# Altium schematic sheet Printer.SchDoc: Smart Bus Ticketing Machine/Outputs/Printer
size A; ApprovedBy: Kiran Gunathilaka; CheckedBy: Kiran Gunathilaka; Author: Kiran Gunathilaka; DrawnBy: Kiran Gunathilaka; Engineer: Kiran Gunathilaka; DocumentNumber: 10; Revision: v1.2; SheetNumber: 10; SheetTotal: 11
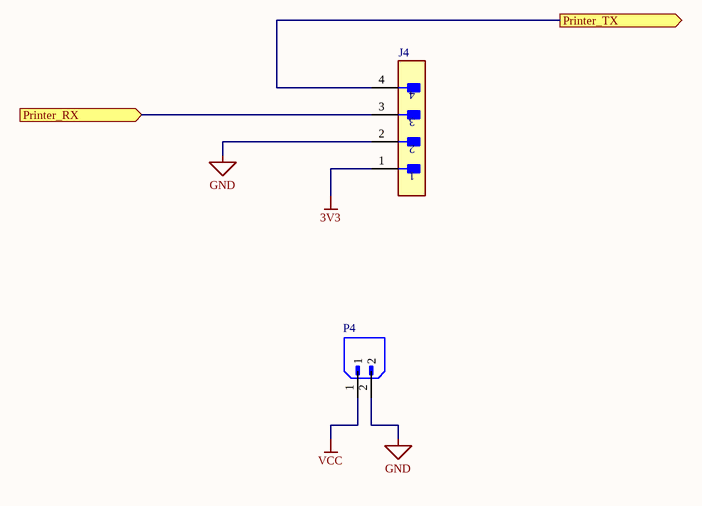
[diagram p0: Printer.SchDoc]

## Parts
J4  B04B-XASK-1(LF)(SN)  [FP-B04B-XASK-1_LF_SN-MFG]  (value not drawn)
P4  Battery Connector  [JST_B2B-XH-A(LF)(SN)]  (value not drawn)

## Ports
Printer_RX (in, see Outputs[3C], Outputs[2C]), Printer_TX (out, see Outputs[3C], Outputs[4C])

## Nets
3V3: J4.1
GND: J4.2 P4.2
VCC: P4.1
Printer_RX: J4.3 ; port Printer_RX
Printer_TX: J4.4 ; port Printer_TX

## Library data of the parts
J4 = CMP-17439-000018-1: CONN HEADER VERT 4POS 2.5MM; Manufacturer: JST; Current Rating: 3A; Voltage Rating: 250V; Conn Orientation: Straight; Conn Gender: Male; Number Of Contacts: 4; ComponentLink2Description: Datasheet; Package: B04B-XASK-1(LF)(SN); Octopart: https://octopart.com/b04b-xask-1%28lf%29%28sn%29-jst-3990149; Pitch: 2.5mm; Device Class L1: Connectors; RoHS: TRUE; Device Class L3: unset; Manufacturer Part Number: B04B-XASK-1(LF)(SN); Temperature Range High: +85°C; Height: 8.8mm; Lead Free: Yes; Category: Conn; Temperature: -25°C to +85°C; Digikey Description: CONN HEADER VERT 4POS 2.5MM; Temperature Range Low: -25°C; ComponentLink2URL: http://www.jst-mfg.com/product/pdf/eng/eXA1.pdf; Contact Material: Tin,Copper; Device Class L2: Headers and Wire Housings; Automotive: No; Number Of Rows: 1
P4 = TX_RX Header